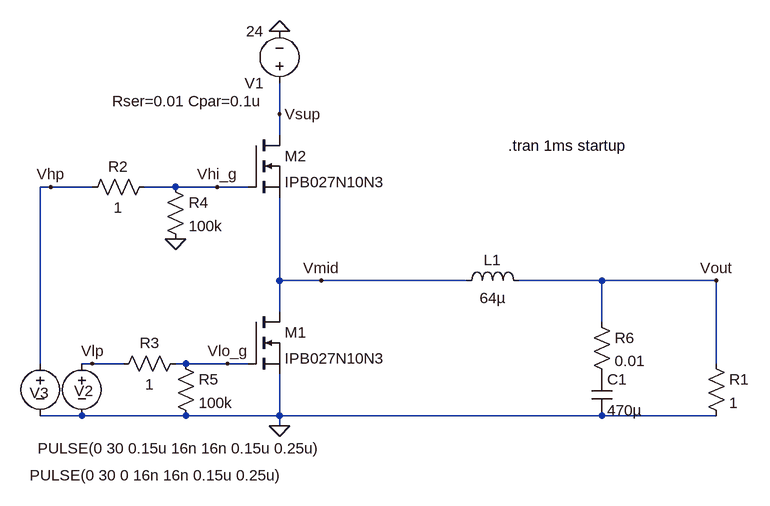
[diagram p0: schematic MOSFET_Heat_Sim_Pulse.asc]
MOSFET_Heat_Sim_Pulse.asc, the LTspice schematic file:
Version 4
SHEET 1 968 680
WIRE 240 -176 240 -224
WIRE 240 -144 240 -176
WIRE -112 -64 -128 -64
WIRE -48 -64 -112 -64
WIRE 80 -64 32 -64
WIRE 144 -64 80 -64
WIRE 192 -64 144 -64
WIRE 240 80 240 -48
WIRE 304 80 240 80
WIRE 528 80 304 80
WIRE 736 80 608 80
WIRE 912 80 736 80
WIRE 240 128 240 80
WIRE 736 144 736 80
WIRE -128 208 -128 -64
WIRE -48 208 -64 208
WIRE 0 208 -48 208
WIRE 96 208 80 208
WIRE 160 208 96 208
WIRE 192 208 160 208
WIRE 912 208 912 80
WIRE -64 288 -128 288
WIRE 96 288 -64 288
WIRE 240 288 240 224
WIRE 240 288 96 288
WIRE 736 288 240 288
WIRE 912 288 736 288
WIRE 240 304 240 288
FLAG 240 304 0
FLAG 240 -304 0
FLAG 80 16 0
FLAG 912 80 Vout
FLAG 144 -64 Vhi_g
FLAG 160 208 Vlo_g
FLAG 304 80 Vmid
FLAG -112 -64 Vhp
FLAG -48 208 Vlp
FLAG 240 -176 Vsup
SYMBOL nmos 192 128 R0
SYMATTR InstName M1
SYMATTR Value IPB027N10N3
SYMBOL nmos 192 -144 R0
SYMATTR InstName M2
SYMATTR Value IPB027N10N3
SYMBOL res 896 192 R0
SYMATTR InstName R1
SYMATTR Value 1
SYMBOL voltage 240 -208 R180
WINDOW 123 0 0 Left 0
WINDOW 39 24 -12 Left 2
SYMATTR SpiceLine Rser=0.01 Cpar=0.1u
SYMATTR InstName V1
SYMATTR Value 24
SYMBOL voltage -64 192 R0
WINDOW 0 -12 58 Left 2
WINDOW 3 -68 146 Left 2
WINDOW 123 0 0 Left 0
WINDOW 39 0 0 Left 0
SYMATTR InstName V2
SYMATTR Value PULSE(0 30 0.15u 16n 16n 0.15u 0.25u)
SYMBOL res 48 -80 R90
WINDOW 0 0 56 VBottom 2
WINDOW 3 32 56 VTop 2
SYMATTR InstName R2
SYMATTR Value 1
SYMBOL res 96 192 R90
WINDOW 0 0 56 VBottom 2
WINDOW 3 32 56 VTop 2
SYMATTR InstName R3
SYMATTR Value 1
SYMBOL res 64 -80 R0
SYMATTR InstName R4
SYMATTR Value 100k
SYMBOL res 80 192 R0
SYMATTR InstName R5
SYMATTR Value 100k
SYMBOL cap 720 224 R0
SYMATTR InstName C1
SYMATTR Value 470µ
SYMBOL res 720 128 R0
SYMATTR InstName R6
SYMATTR Value 0.01
SYMBOL ind 512 96 R270
WINDOW 0 32 56 VTop 2
WINDOW 3 5 56 VBottom 2
SYMATTR InstName L1
SYMATTR Value 64µ
SYMBOL voltage -128 192 R0
WINDOW 0 -16 61 Left 2
WINDOW 3 -16 188 Left 2
WINDOW 123 0 0 Left 0
WINDOW 39 0 0 Left 0
SYMATTR InstName V3
SYMATTR Value PULSE(0 30 0 16n 16n 0.15u 0.25u)
TEXT 592 -128 Left 2 !.tran 1ms startup

The netlist it stands for:
* MOSFET_Heat_Sim_Pulse.asc
M1 Vmid Vlo_g 0 0 IPB027N10N3
M2 Vsup Vhi_g Vmid Vmid IPB027N10N3
R1 Vout 0 1
V1 Vsup 0 24 Rser=0.01 Cpar=0.1u
V2 Vlp 0 PULSE(0 30 0.15u 16n 16n 0.15u 0.25u)
R2 Vhi_g Vhp 1
R3 Vlo_g Vlp 1
R4 Vhi_g 0 100k
R5 Vlo_g 0 100k
C1 P001 0 470µ
R6 Vout P001 0.01
L1 Vmid Vout 64µ
V3 Vhp 0 PULSE(0 30 0 16n 16n 0.15u 0.25u)
.model NMOS NMOS
.model PMOS PMOS
.lib standard.mos
.tran 1ms startup
.backanno
.end